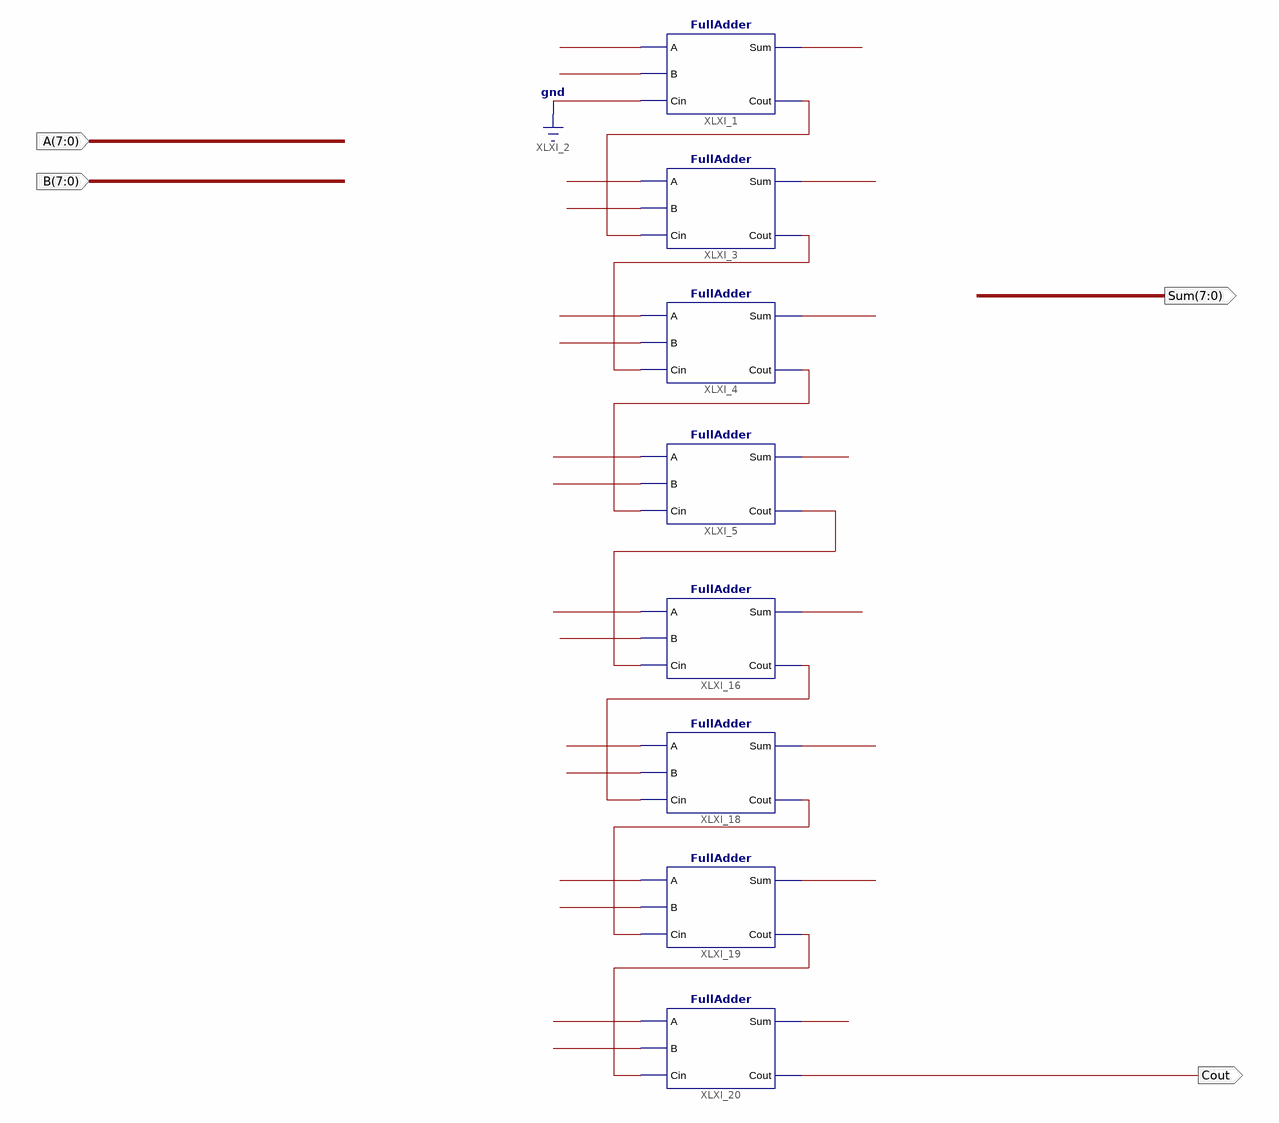
[diagram p0: schematic sheet 1]
// Xilinx ISE schematic EightBitAdder.sch (spartan6) as structural Verilog: 8 symbols, 4 ports
module EightBitAdder (
  input  [7:0] A,
  input  [7:0] B,
  output [7:0] Sum,
  output Cout
);

  wire XLXN_8, XLXN_10, XLXN_12, XLXN_24, XLXN_26, XLXN_28, XLXN_30;

  FullAdder XLXI_1 (.A(A[0]), .B(B[0]), .Cin(1'b0), .Sum(Sum[0]), .Cout(XLXN_10));
  FullAdder XLXI_3 (.A(A[1]), .B(B[1]), .Cin(XLXN_10), .Sum(Sum[1]), .Cout(XLXN_12));
  FullAdder XLXI_4 (.A(A[2]), .B(B[2]), .Cin(XLXN_12), .Sum(Sum[2]), .Cout(XLXN_8));
  FullAdder XLXI_5 (.A(A[3]), .B(B[3]), .Cin(XLXN_8), .Sum(Sum[3]), .Cout(XLXN_30));
  FullAdder XLXI_18 (.A(A[5]), .B(B[5]), .Cin(XLXN_26), .Sum(Sum[5]), .Cout(XLXN_28));
  FullAdder XLXI_19 (.A(A[6]), .B(B[6]), .Cin(XLXN_28), .Sum(Sum[6]), .Cout(XLXN_24));
  FullAdder XLXI_20 (.A(A[7]), .B(B[7]), .Cin(XLXN_24), .Sum(Sum[7]), .Cout(Cout));
  FullAdder XLXI_16 (.A(A[4]), .B(B[4]), .Cin(XLXN_30), .Sum(Sum[4]), .Cout(XLXN_26));
endmodule
